# EAGLE design Trap Lighting Programmable SpectrumV03B (EAGLE 8.4.3)
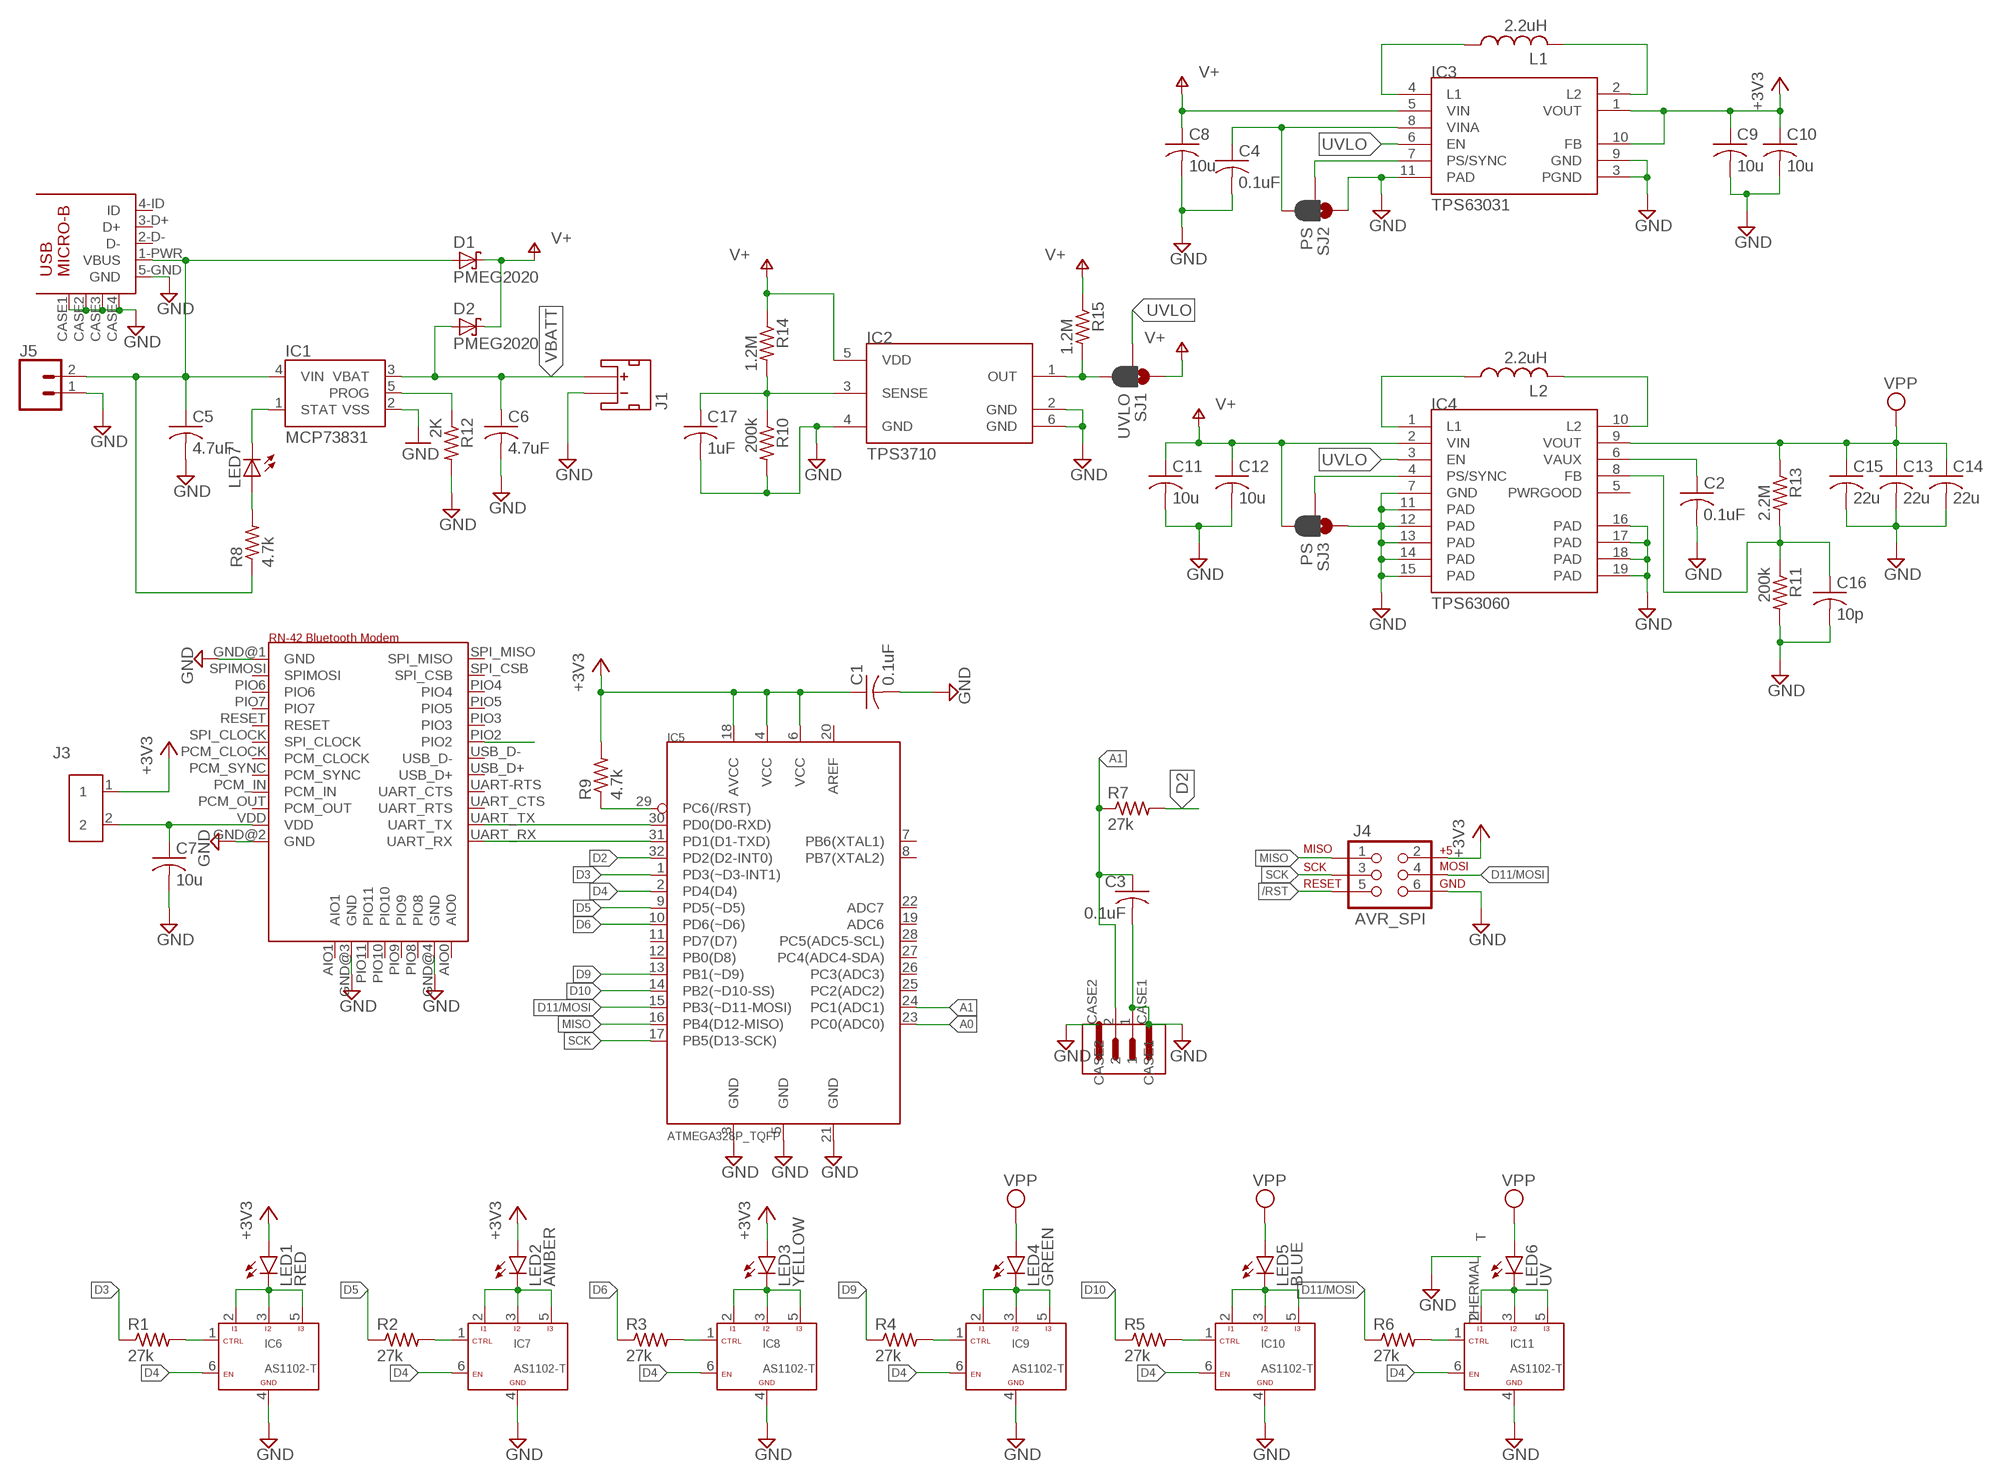
[diagram p0: schematic, sheet 1]

## Parts
A1  RN-42_BLUETOOTH  [RN-42]
C1  0.1uF  C-USC0805  [C0805]
C2  0.1uF  C-USC0805  [C0805]
C3  0.1uF  C-USC0805  [C0805]
C4  0.1uF  C-USC0805  [C0805]
C5  4.7uF  C-USC0805  [C0805]
C6  4.7uF  C-USC0805  [C0805]
C7  10u  C-USC0805  [C0805]
C8  10u  C-USC0805  [C0805]
C9  10u  C-USC0805  [C0805]
C10  10u  C-USC0805  [C0805]
C11  10u  C-USC0805  [C0805]
C12  10u  C-USC0805  [C0805]
C13  22u  C-USC1206  [C1206]
C14  22u  C-USC1206  [C1206]
C15  22u  C-USC1206  [C1206]
C16  10p  C-USC0805  [C0805]
C17  1uF  C-USC0805  [C0805]
D1  PMEG2020  BAT60J  [SOD323_ST]
D2  PMEG2020  BAT60J  [SOD323_ST]
IC1  MCP73831  MCP73831SMD  [SOT23-5]
IC2  TPS3710  [SOT6]
IC3  TPS63031  [VSON-10]
IC4  TPS63060  [WSON1-10]
IC5  ATMEGA328P_TQFP  [TQFP-32]
IC6  AS1102-T  [SC70-6]
IC7  AS1102-T  [SC70-6]
IC8  AS1102-T  [SC70-6]
IC9  AS1102-T  [SC70-6]
IC10  AS1102-T  [SC70-6]
IC11  AS1102-T  [SC70-6]
J1  JST_2MM_MALE  [JST-2-SMD]
J2  2PIN_SMD_PHOENIX_CONTACTVERTICAL_PACKAGE  [2-PIN-VERT-PHOENIX_SMD]
J3  2MM_SMD_M_HEADER  [2MM_MALE_SMD_HEADER]
J4  AVR_SPI  AVR_SPI_PRG_6PTH  [2X3]
J5  CONN_02PTH3  [1X02_LONGPADS]
L1  2.2uH  VLF302512MT-2R2M-CA_INDUCTOR  [VLF302512MT-2R2M-CA_INDUCTOR]
L2  2.2uH  VLF302512MT-2R2M-CA_INDUCTOR  [VLF302512MT-2R2M-CA_INDUCTOR]
LED1  RED  LED_TT_OVS5MXTT_OVS5MX  [LED_TT_OVS5MX]
LED2  AMBER  LED_TT_OVS5MXTT_OVS5MX  [LED_TT_OVS5MX]
LED3  YELLOW  LED_TT_OVS5MXTT_OVS5MX  [LED_TT_OVS5MX]
LED4  GREEN  LED_TT_OVS5MXLUXEON_3535L  [LED_LUXEON_3535L]
LED5  BLUE  LED_TT_OVS5MXTT_OVS5MX  [LED_TT_OVS5MX]
LED6  UV  LITEON_CO34UV_LED  [LED_LITEON_CO3_UV]
LED7  LEDCHIPLED_0805  [CHIPLED_0805]
R1  27k  R-US_R0805  [R0805]
R2  27k  R-US_R0805  [R0805]
R3  27k  R-US_R0805  [R0805]
R4  27k  R-US_R0805  [R0805]
R5  27k  R-US_R0805  [R0805]
R6  27k  R-US_R0805  [R0805]
R7  27k  R-US_R0805  [R0805]
R8  4.7k  R-US_R0805  [R0805]
R9  4.7k  R-US_R0805  [R0805]
R10  200k  R-US_R0805  [R0805]
R11  200k  R-US_R0805  [R0805]
R12  2K  R-US_R0805  [R0805]
R13  2.2M  R-US_R0805  [R0805]
R14  1.2M  R-US_R0805  [R0805]
R15  1.2M  R-US_R0805  [R0805]
SJ1  UVLO  JUMPER-SMT_3_1-NC_PASTE_SILK  [SMT-JUMPER_3_1-NC_PASTE_SILK]
SJ2  PS  JUMPER-SMT_3_1-NC_PASTE_SILK  [SMT-JUMPER_3_1-NC_PASTE_SILK]
SJ3  PS  JUMPER-SMT_3_1-NC_PASTE_SILK  [SMT-JUMPER_3_1-NC_PASTE_SILK]
USB1  USB-MICRO-B  [USB_MICRO_B_WURTH_629105136821]

## Nets
3.3V: C1.1 C9.1 C10.1 IC3.1(VOUT) IC3.10(FB) IC5.4(VCC) IC5.6(VCC) IC5.18(AVCC) J3.1 J4.2 LED1.A LED2.A LED3.A R9.2 ; supply symbol labelled +3V3
/RST: IC5.29(PC6(/RST)) J4.5 R9.1
A0: IC5.23(PC0(ADC0))
A1: C3.1 IC5.24(PC1(ADC1)) J2.2 R7.1
BT_CONNECT: A1.PIO2
D2: IC5.32(PD2(D2-INT0)) R7.2
D3: IC5.1(PD3(~D3-INT1)) R1.1
D4: IC5.2(PD4(D4)) IC6.6(EN) IC7.6(EN) IC8.6(EN) IC9.6(EN) IC10.6(EN) IC11.6(EN)
D5: IC5.9(PD5(~D5)) R2.1
D6: IC5.10(PD6(~D6)) R3.1
D9: IC5.13(PB1(~D9)) R4.1
D10: IC5.14(PB2(~D10-SS)) R5.1
D11/MOSI: IC5.15(PB3(~D11-MOSI)) J4.4 R6.1
GND: A1.GND@1(GND) A1.GND@2(GND) A1.GND@3(GND) A1.GND@4(GND) C1.2 C2.2 C3.2 C4.2 C5.2 C6.2 C7.2 C8.2 C9.2 C10.2 C11.2 C12.2 C13.2 C14.2 C15.2 C16.2 C17.2 IC1.2(VSS) IC2.2(GND) IC2.4(GND) IC2.6(GND) IC3.3(PGND) IC3.9(GND) IC3.11(PAD) IC4.7(GND) IC4.11(PAD) IC4.12(PAD) IC4.13(PAD) IC4.14(PAD) IC4.15(PAD) IC4.16(PAD) IC4.17(PAD) IC4.18(PAD) IC4.19(PAD) IC5.3(GND) IC5.5(GND) IC5.21(GND) IC6.4(GND) IC7.4(GND) IC8.4(GND) IC9.4(GND) IC10.4(GND) IC11.4(GND) J1.1(-) J2.1 J2.CASE1 J2.CASE2 J4.6 J5.1 LED6.THERMAL(T) R10.2 R11.2 R12.2 SJ2.1 SJ3.1 USB1.5-GND(GND) USB1.CASE1(CASE) USB1.CASE2(CASE) USB1.CASE3(CASE) USB1.CASE4(CASE)
MCURX: A1.UART_TX IC5.30(PD0(D0-RXD))
MCUTX: A1.UART_RX IC5.31(PD1(D1-TXD))
MISO: IC5.16(PB4(D12-MISO)) J4.1
N$1: IC1.1(STAT) LED7.C
N$2: IC8.1(CTRL) R3.2
N$3: IC9.1(CTRL) R4.2
N$4: IC2.1(OUT) R15.2 SJ1.3
N$5: A1.VDD C7.1 J3.2
N$6: IC10.1(CTRL) R5.2
N$7: IC11.1(CTRL) R6.2
N$8: IC7.1(CTRL) R2.2
N$9: LED7.A R8.2
N$11: IC1.5(PROG) R12.1
N$12: C17.1 IC2.3(SENSE) R10.1 R14.2
N$13: IC3.2(L2) L1.2
N$14: IC3.4(L1) L1.1
N$15: IC3.7(PS/SYNC) SJ2.2
N$17: IC8.2(I1) IC8.3(I2) IC8.5(I3) LED3.C
N$18: IC9.2(I1) IC9.3(I2) IC9.5(I3) LED4.C
N$19: IC10.2(I1) IC10.3(I2) IC10.5(I3) LED5.C
N$20: IC11.2(I1) IC11.3(I2) IC11.5(I3) LED6.K(C)
N$21: IC7.2(I1) IC7.3(I2) IC7.5(I3) LED2.C
N$22: IC6.1(CTRL) R1.2
N$23: C4.1 IC3.8(VINA) SJ2.3
N$24: IC6.2(I1) IC6.3(I2) IC6.5(I3) LED1.C
N$26: IC4.4(PS/SYNC) SJ3.2
N$27: IC4.1(L1) L2.1
N$28: IC4.10(L2) L2.2
N$30: C2.1 IC4.6(VAUX)
N$31: C16.1 IC4.8(FB) R11.1 R13.2
SCK: IC5.17(PB5(D13-SCK)) J4.3
USB_VIN: C5.1 D1.A IC1.4(VIN) J5.2 R8.1 USB1.1-PWR(VBUS)
UVLO: IC3.6(EN) IC4.3(EN) SJ1.2
V+: C8.1 C11.1 C12.1 D1.C D2.C IC2.5(VDD) IC3.5(VIN) IC4.2(VIN) R14.1 R15.1 SJ1.1 SJ3.3
VBATT: C6.1 D2.A IC1.3(VBAT) J1.2(+)
VPP: C13.1 C14.1 C15.1 IC4.9(VOUT) LED4.A LED5.A LED6.A R13.1
Unconnected: A1.AIO0 A1.AIO1 A1.PCM_CLOCK A1.PCM_IN A1.PCM_OUT A1.PCM_SYNC A1.PIO3 A1.PIO4 A1.PIO5 A1.PIO6 A1.PIO7 A1.PIO8 A1.PIO9 A1.PIO10 A1.PIO11 A1.RESET A1.SPI_CLOCK A1.SPI_CSB A1.SPI_MISO A1.SPIMOSI A1.UART-RTS(UART_CTS) A1.UART_CTS(UART_RTS) A1.USB_D+ A1.USB_D- IC4.5(PWRGOOD) IC5.7(PB6(XTAL1)) IC5.8(PB7(XTAL2)) IC5.11(PD7(D7)) IC5.12(PB0(D8)) IC5.19(ADC6) IC5.20(AREF) IC5.22(ADC7) IC5.25(PC2(ADC2)) IC5.26(PC3(ADC3)) IC5.27(PC4(ADC4-SDA)) IC5.28(PC5(ADC5-SCL)) J1.NC1(PAD1) J1.NC2(PAD2) USB1.2-D-(D-) USB1.3-D+(D+) USB1.4-ID(ID)

## Library data of the parts
A1 = be-420-custom-parts:RN-42_BLUETOOTH
C1-C17 = rcl:C-US: CAPACITOR, American symbol
D1 D2 = diode:BAT60J: Schottky barrier diode Source: www.st.com, BAT60J.pdf
IC1 = SparkFun:MCP73831
IC2 = 1A_Jenkins_2013:TPS3710: TPS3710 Power supply supervisor / comparator
IC3 = 1A_Jenkins_2013:TPS63031: TPS63031 buck-boost 3.3V regulator, 1 A
IC4 = 1A_Jenkins_2013:TPS63060: TPS63060 BUCK-BOOST 2A Regulator, WSON10 Package
IC5 = 1A_Jenkins_2013:ATMEGA328P_TQFP
IC6-IC11 = 1A_Jenkins_2013:AS1102-T
J1 = SparkFun-Connectors:JST_2MM_MALE: JST 2MM MALE RA CONNECTOR Two pin, compact surface mount connector. Commonly used as a battery input connection point. We really like the solid locking feeling and high current rating on these small connectors. We use these all the time as battery connectors. Mates to single-cell LiPo batteries. Here is the connector we sell at SparkFun: JST Right Angle Connector - White <https://www.sparkfun.com/products/8612> (PRT-08612) Datasheet <http://www.sparkfun.com/datasheets/Prototyping/Connectors/JST-Horizontal.pdf> It was used on these SparkFun products: SparkFun MOSFET Power Controller <https://www.sparkfun.com/products/11214> (PRT-11214) SparkFun Battery Babysitter - LiPo Battery Manager <https://www.sparkfun.com/products/13777> (PRT-13777) And many, many others that required a lipo battery connection.; PROD_ID: CONN-11443; SF_ID: PRT-08612
J2 = 1A_Jenkins_2013:2PIN_SMD_PHOENIX_CONTACT
J3 = 1A_Jenkins_2013:2MM_SMD_M_HEADER
J4 = SparkFun:AVR_SPI_PRG_6: AVR ISP 6 Pin This is the reduced ISP connector for AVR programming. Common on Arduino. This footprint will take up less PCB space and can be used with a 10-pin to 6-pin adapter such as SKU: BOB-08508
J5 = SparkFun-Connectors:CONN_02: Multi connection point. Often used as Generic Header-pin footprint for 0.1 inch spaced/style header connections On any of the 0.1 inch spaced packages, you can populate with these: Break Away Headers - Straight <https://www.sparkfun.com/products/116> (PRT-00116) Break Away Male Headers - Right Angle <https://www.sparkfun.com/products/553> (PRT-00553) Female Headers <https://www.sparkfun.com/products/115> (PRT-00115) Break Away Headers - Machine Pin <https://www.sparkfun.com/products/117> (PRT-00117) Break Away Female Headers - Swiss Machine Pin <https://www.sparkfun.com/products/743> (PRT-00743) For SCREWTERMINALS and SPRING TERMINALS visit here: Screw Terimnals on SparkFun.com <https://www.sparkfun.com/search/results?term=Screw+Terminals> (5mm/3.5mm/2.54mm spacing) This device is also useful as a general connection point to wire up your design to another part of your project. Our various solder wires solder well into these plated through hole pads. Hook-Up Wire - Assortment (Stranded, 22 AWG) <https://www.sparkfun.com/products/11375> (PRT-11375) Hook-Up Wire - Assortment (Solid Core, 22 AWG) <https://www.sparkfun.com/products/11367> (PRT-11367) View the entire wire category on our website here <https://www.sparkfun.com/categories/141> Special notes: Molex polarized connector foot print use with: PRT-08233 with associated crimp pins and housings. 2.54_SCREWTERM for use with PRT-10571. 3.5mm Screw Terminal footprints for PRT-08084 5mm Screw Terminal footprints for use with PRT-08432
L1 L2 = 1A_Jenkins_2013:VLF302512MT-2R2M-CA_INDUCTOR
LED1-LED5 = 1A_Jenkins_2013:LED_TT_OVS5MX
LED6 = 1A_Jenkins_2013:LITEON_CO34UV_LED
LED7 = led:LED: LED OSRAM: - CHIPLED LG R971, LG N971, LY N971, LG Q971, LY Q971, LO R971, LY R971 LH N974, LH R974 LS Q976, LO Q976, LY Q976 LO Q996 - Hyper CHIPLED LW Q18S LB Q993, LB Q99A, LB R99A - SideLED LS A670, LO A670, LY A670, LG A670, LP A670 LB A673, LV A673, LT A673, LW A673 LH A674 LY A675 LS A676, LA A676, LO A676, LY A676, LW A676 LS A679, LY A679, LG A679 - Hyper Micro SIDELED® LS Y876, LA Y876, LO Y876, LY Y876 LT Y87S - SmartLED LW L88C, LW L88S LB L89C, LB L89S, LG L890 LS L89K, LO L89K, LY L89K LS L896, LA L896, LO L896, LY L896 - TOPLED LS T670, LO T670, LY T670, LG T670, LP T670 LSG T670, LSP T670, LSY T670, LOP T670, LYG T670 LG T671, LOG T671, LSG T671 LB T673, LV T673, LT T673, LW T673 LH T674 LS T676, LA T676, LO T676, LY T676, LB T676, LH T676, LSB T676, LW T676 LB T67C, LV T67C, LT T67C, LS T67K, LO T67K, LY T67K, LW E67C LS E67B, LA E67B, LO E67B, LY E67B, LB E67C, LV E67C, LT E67C LW T67C LS T679, LY T679, LG T679 LS T770, LO T770, LY T770, LG T770, LP T770 LB T773, LV T773, LT T773, LW T773 LH T774 LS E675, LA E675, LY E675, LS T675 LS T776, LA T776, LO T776, LY T776, LB T776 LHGB T686 LT T68C, LB T68C - Hyper Mini TOPLED® LB M676 - Mini TOPLED Santana® LG M470 LS M47K, LO M47K, LY M47K Source: http://www.osram.convergy.de LUXEON: - LUMILED® LXK2-PW12-R00, LXK2-PW12-S00, LXK2-PW14-U00, LXK2-PW14-V00 LXK2-PM12-R00, LXK2-PM12-S00, LXK2-PM14-U00 LXK2-PE12-Q00, LXK2-PE12-R00, LXK2-PE12-S00, LXK2-PE14-T00, LXK2-PE14-U00 LXK2-PB12-K00, LXK2-PB12-L00, LXK2-PB12-M00, LXK2-PB14-N00, LXK2-PB14-P00, LXK2-PB14-Q00 LXK2-PR12-L00, LXK2-PR12-M00, LXK2-PR14-Q00, LXK2-PR14-R00 LXK2-PD12-Q00, LXK2-PD12-R00, LXK2-PD12-S00 LXK2-PH12-R00, LXK2-PH12-S00 LXK2-PL12-P00, LXK2-PL12-Q00, LXK2-PL12-R00 Source: www.luxeon.com KINGBRIGHT: KA-3528ASYC Source: www.kingbright.com
R1-R15 = rcl:R-US_: RESISTOR, American symbol
SJ1-SJ3 = SparkFun-Jumpers:JUMPER-SMT_3_1-NC_PASTE: Normally closed solder jumper (1 of 2 connections) This jumper has an aperture in the stencil to allow solder paste to bridge one of the two connections. One connection is normally closed (NC), while the other is normally open (NO). Wick off the solder to open the connection. Reapply solder to reclose the connection. Apply solder to the other side instead to change the current path.
USB1 = 1A_Jenkins_2013:USB-MICRO-B

## Net classes
1 VCC: width 0.381 mm
2 LEDPower: width 0.203 mm
3 ButtonSignal: width 0.203 mm

## Board
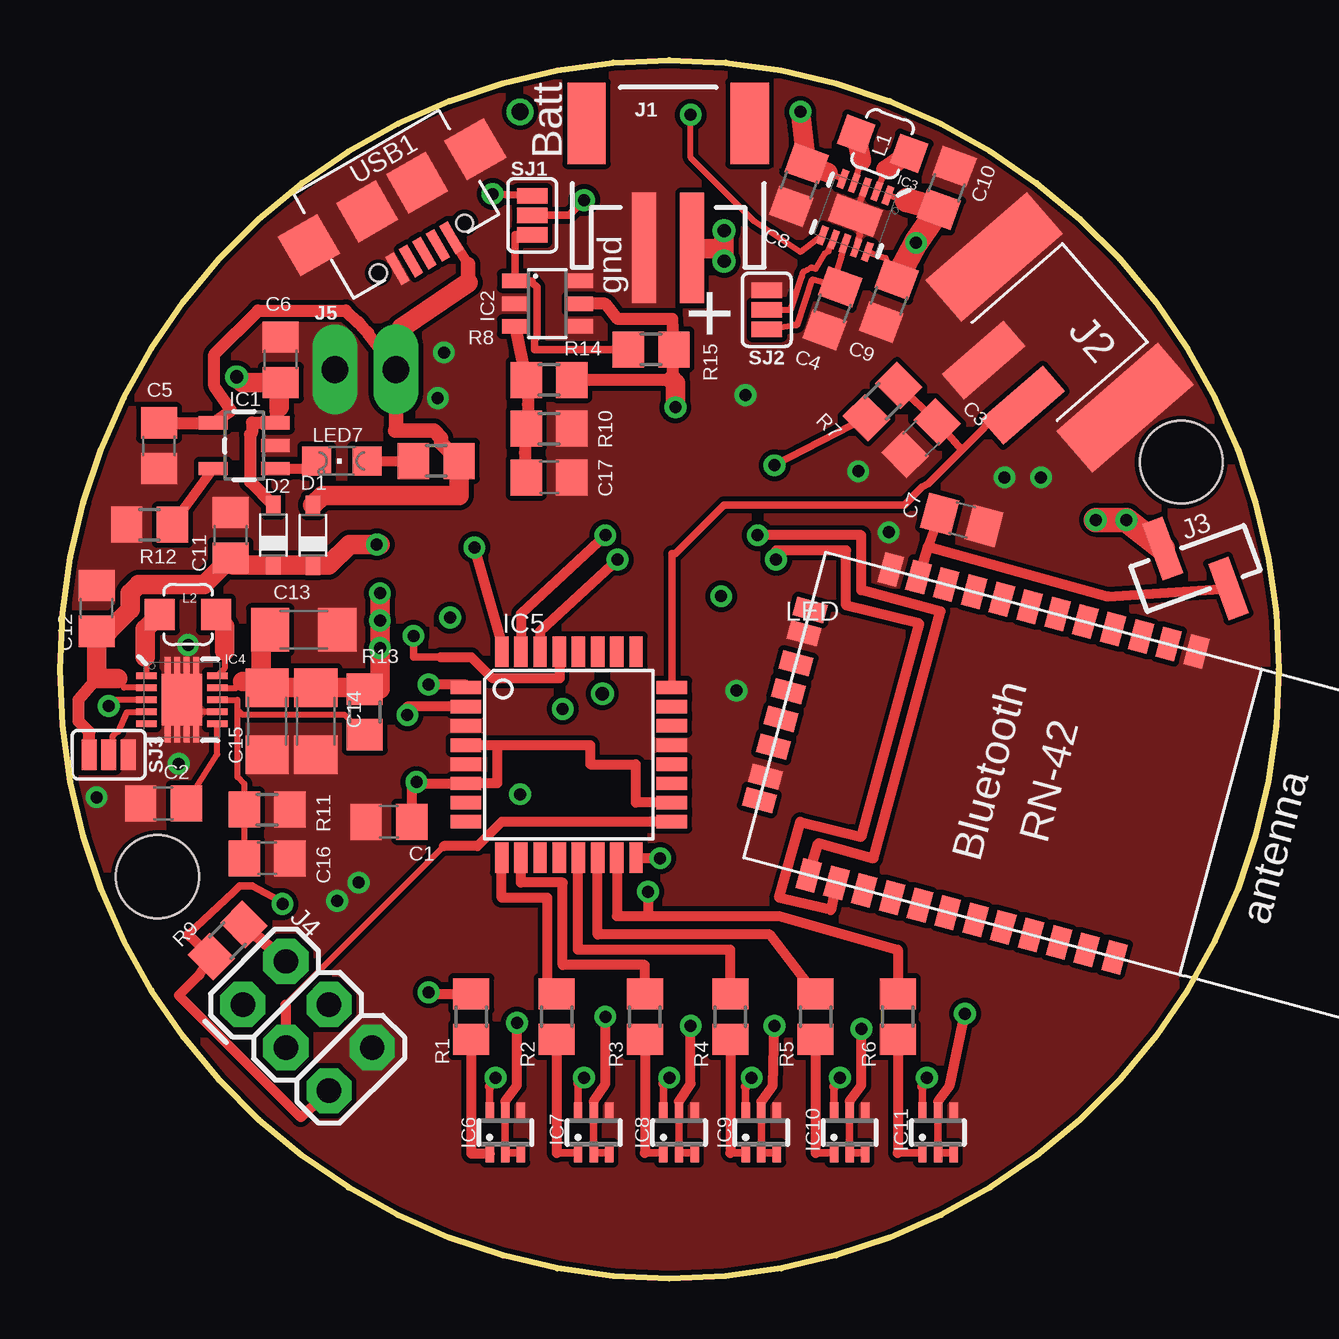
[diagram p1: board, top side]
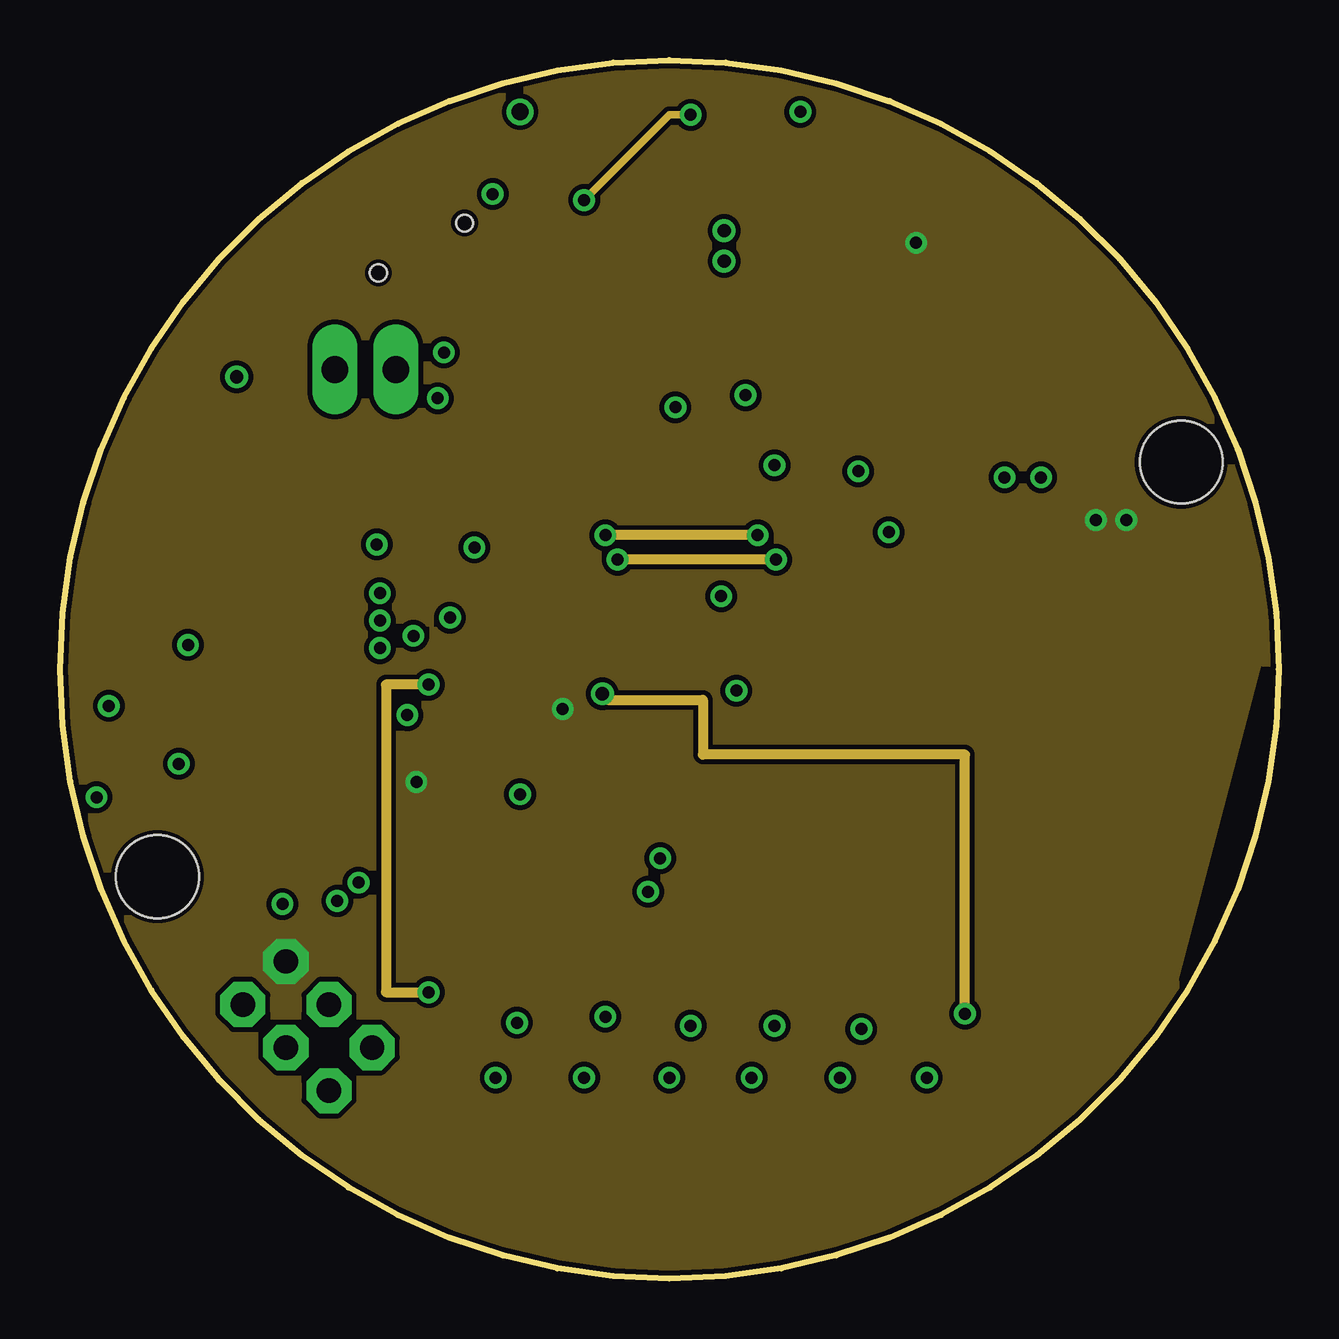
[diagram p2: board, inner layer Route2]
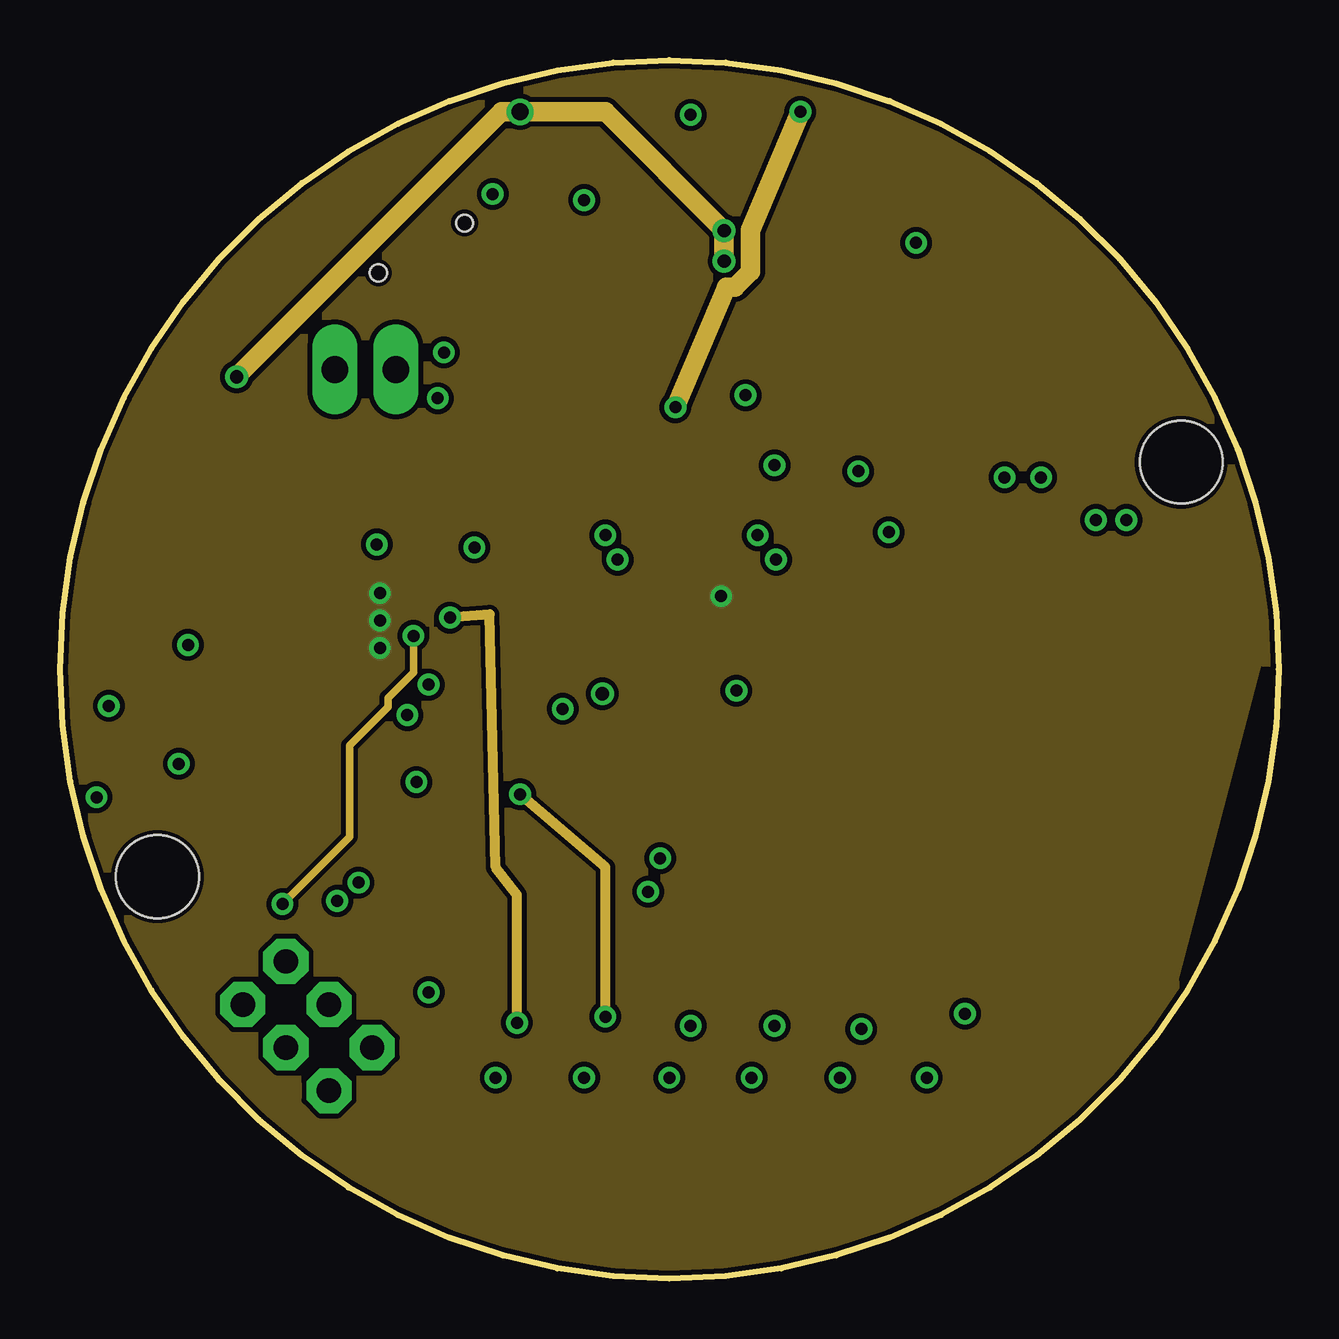
[diagram p3: board, inner layer Route15]
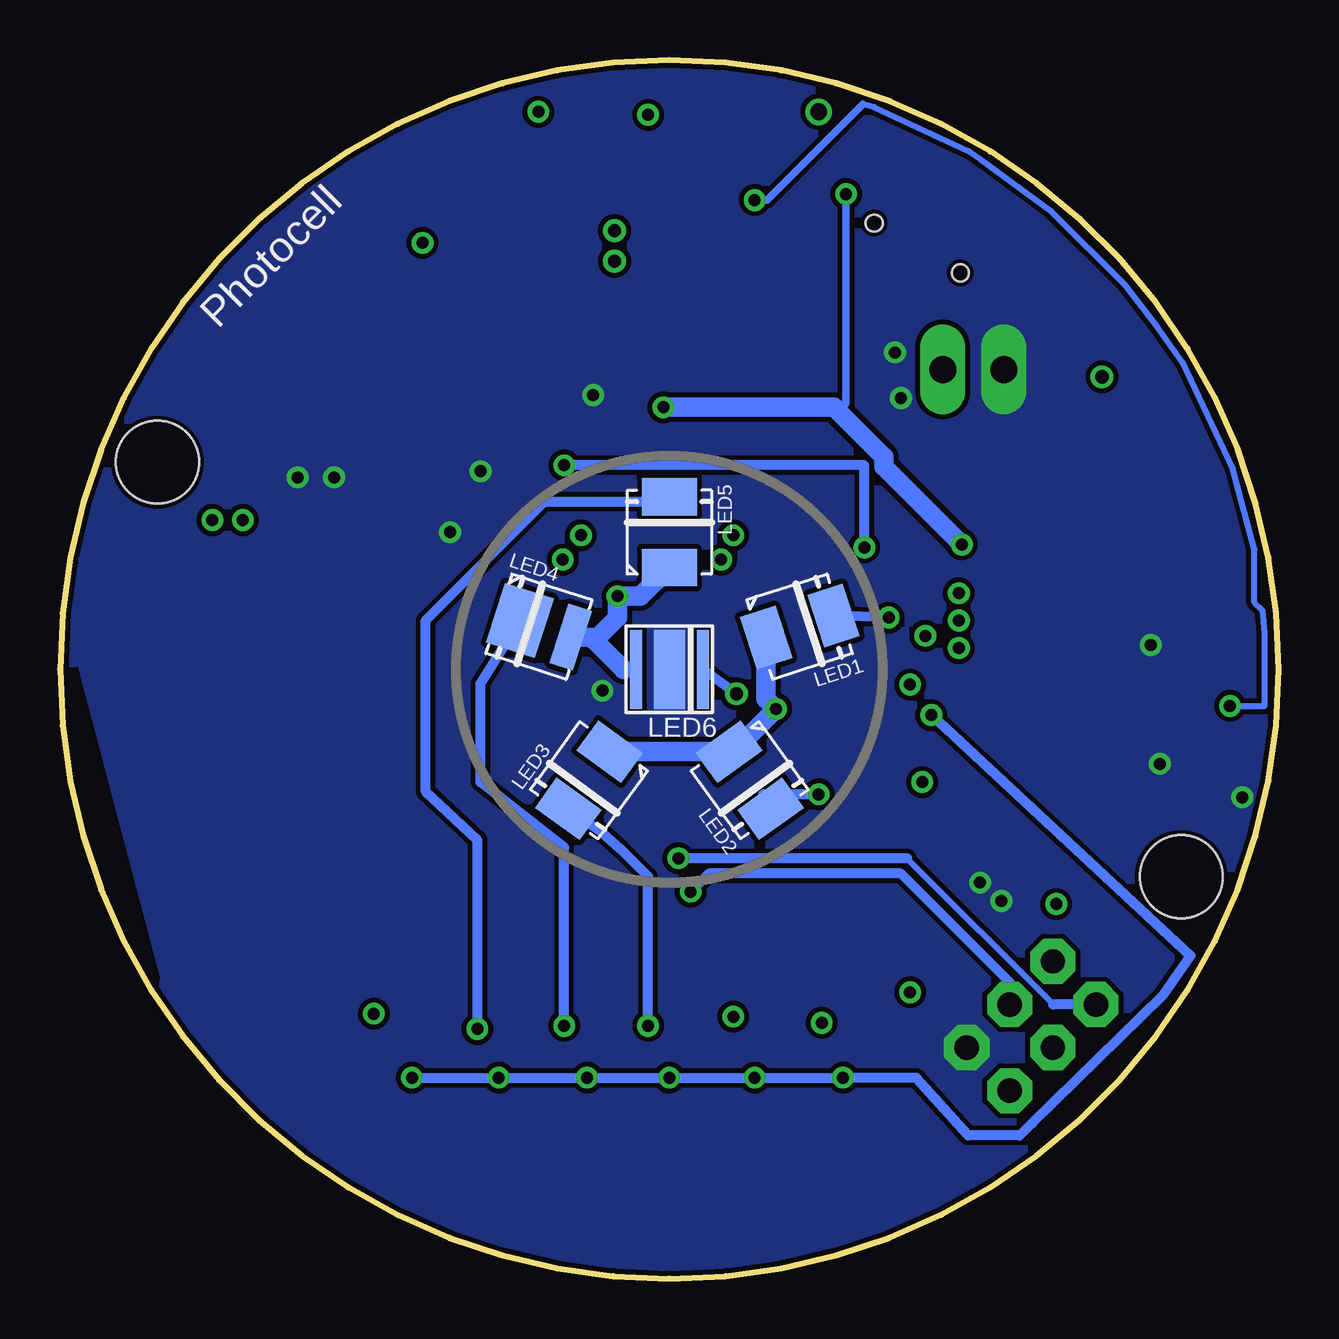
[diagram p4: board, bottom side, seen from below]

Size 50.8 x 50.8 mm. Coordinates in mm from the lower left corner, seen from the top.
Outline: 0,25.4 arc-90 25.4,50.8 arc-90 50.8,25.4 arc-90 25.4,0 arc-90 0,25.4
Copper layers (1+2*15+16): Top 0.035mm / dielectric 0.5mm / Route2 0.035mm / dielectric 0.5mm / Route15 0.035mm / dielectric 0.5mm / Bottom 0.035mm
Design rules "default *": minimum track width 10mil, minimum drill 16mil, track to track 8mil, track to pad 8mil, pad to pad 8mil, via to via 8mil, smd to smd 8mil, copper to edge 8mil, drill to drill 8mil, minimum pad ring 10mil, minimum via ring 8mil, stop-mask expansion 4mil, vias tented up to drill 0mil, thermal gap 10mil
Holes 3.45 mm at 46.74,34.04 4.06,16.76

### Footprints (pad centres in the part's own frame; a part is rotated, then mirrored left to right if it is on the bottom)
RN-42 = smd 0.8 x 1.3: AIO0 4.1,-12.9; AIO1 -4.1,-12.9; GND@3 -3.1,-12.9; GND@4 3.1,-12.9; PIO8 1.8,-12.9; PIO9 0.6,-12.9; PIO10 -0.6,-12.9; PIO11 -1.8,-12.9 | smd 1.3 x 0.8: GND@1 -6.6,3.1; GND@2 -6.6,-10.1; PCM_CLOCK -6.6,-4.1; PCM_IN -6.6,-6.5; PCM_OUT -6.6,-7.7; PCM_SYNC -6.6,-5.3; PIO2 6.6,-2.9; PIO3 6.6,-1.7; PIO4 6.6,0.7; PIO5 6.6,-0.5; PIO6 -6.6,0.7; PIO7 -6.6,-0.5; RESET -6.6,-1.7; SPI_CLOCK -6.6,-2.9; SPI_CSB 6.6,1.9; SPI_MISO 6.6,3.1; SPIMOSI -6.6,1.9; UART-RTS 6.6,-7.7; UART_CTS 6.6,-6.5; UART_RX 6.6,-10.1; UART_TX 6.6,-8.9; USB_D+ 6.6,-5.3; USB_D- 6.6,-4.1; VDD -6.6,-8.9
C0805 = smd 1.3 x 1.5: 1 -0.95,0; 2 0.95,0
C1206 = smd 1.6 x 1.8: 1 -1.4,0; 2 1.4,0
SOD323_ST = smd 0.8 x 0.6: A 1.25,0; C -1.25,0
SOT23-5 = smd 0.55 x 1.2: 1 -0.95,-1.3; 2 0,-1.3; 3 0.95,-1.3; 4 0.95,1.3; 5 -0.95,1.3
SOT6 = smd 1.1 x 0.6: 1 -1.35,0.95; 2 -1.35,0; 3 -1.35,-0.95; 4 1.35,-0.95; 5 1.35,0; 6 1.35,0.95
VSON-10 = smd 0.8 x 0.28: 1 -1.25,1; 2 -1.25,0.5; 3 -1.25,0; 4 -1.25,-0.5; 5 -1.25,-1; 6 1.25,-1; 7 1.25,-0.5; 8 1.25,0; 9 1.25,0.5; 10 1.25,1 | smd 1.2 x 2: 11 0,0
WSON1-10 = smd 0.85 x 0.28: 1 -1.475,1; 2 -1.475,0.5; 3 -1.475,0; 4 -1.475,-0.5; 5 -1.475,-1; 6 1.475,-1; 7 1.475,-0.5; 8 1.475,0; 9 1.475,0.5; 10 1.475,1 | smd 0.25 x 0.8: 11 0.6,1.375; 12 0.2,1.375; 13 -0.2,1.375; 14 -0.6,1.375; 15 -0.6,-1.375; 16 -0.2,-1.375; 17 0.2,-1.375; 18 0.6,-1.375 | smd 1.7 x 2.15: 19 0,0
TQFP-32 = smd 1.27 x 0.559: 1 -4.293,2.8; 2 -4.293,2; 3 -4.293,1.2; 4 -4.293,0.4; 5 -4.293,-0.4; 6 -4.293,-1.2; 7 -4.293,-2; 8 -4.293,-2.8; 17 4.293,-2.8; 18 4.293,-2; 19 4.293,-1.2; 20 4.293,-0.4; 21 4.293,0.4; 22 4.293,1.2; 23 4.293,2; 24 4.293,2.8 | smd 0.559 x 1.27: 9 -2.8,-4.293; 10 -2,-4.293; 11 -1.2,-4.293; 12 -0.4,-4.293; 13 0.4,-4.293; 14 1.2,-4.293; 15 2,-4.293; 16 2.8,-4.293; 25 2.8,4.293; 26 2,4.293; 27 1.2,4.293; 28 0.4,4.293; 29 -0.4,4.293; 30 -1.2,4.293; 31 -2,4.293; 32 -2.8,4.293
SC70-6 = smd 0.8 x 0.35: 1 -0.85,0.63; 2 -0.85,-0.02; 3 -0.85,-0.67; 4 0.85,-0.67; 5 0.85,-0.02; 6 0.85,0.63
JST-2-SMD = smd 1 x 4.6: 1 -1,-3.7; 2 1,-3.7 | smd 1.6 x 3.4: NC1 -3.4,1.5; NC2 3.4,1.5
2-PIN-VERT-PHOENIX_SMD = smd 3.4 x 1.4: 1 -3.15,1.21; 2 -3.15,-1.29 | smd 5.6 x 2.3: CASE1 0,4.16; CASE2 0,-4.16
2MM_MALE_SMD_HEADER = smd 0.89 x 2.5: 1 -1,1.25; 2 1,-1.25
2X3 = drill 1.016 pad 1.88 octagon: 1 0,0; 2 0,2.54; 3 2.54,0; 4 2.54,2.54; 5 5.08,0; 6 5.08,2.54
1X02_LONGPADS = drill 1.118 pad 1.88 long: 1 0,0; 2 2.54,0
VLF302512MT-2R2M-CA_INDUCTOR = smd 1.25 x 1.3: 1 -1.175,0; 2 1.175,0
LED_TT_OVS5MX = smd 1.55 x 2.3: A 1.475,0; C -1.475,0
LED_LUXEON_3535L = smd 1.02 x 2.6: A 1.39,0 | smd 2.13 x 2.6: C -0.835,0
LED_LITEON_CO3_UV = smd 0.5 x 3.3: A 1.4,0; K -1.4,0 | smd 1.3 x 3.3: THERMAL 0,0
CHIPLED_0805 = smd 1.2 x 1.2: A 0,-1.05; C 0,1.05
R0805 = smd 1.3 x 1.5: 1 -0.95,0; 2 0.95,0
SMT-JUMPER_3_1-NC_PASTE_SILK = smd 0.635 x 1.27: 1 -0.813,0; 2 0,0; 3 0.813,0
USB_MICRO_B_WURTH_629105136821 = smd 0.4 x 1.35: 1-PWR -1.3,2.7; 2-D- -0.65,2.7; 3-D+ 0,2.7; 4-ID 0.65,2.7; 5-GND 1.3,2.7 | smd 1.9 x 1.9: CASE1 -4,0; CASE2 -1.2,0; CASE3 1.2,0; CASE4 4,0 | hole 0.7: -2.075,2.45; 2.075,2.45

### Placement (x,y rotation side)
A1  42.67,20.57 255 top
C1  13.72,19.05 180 top
C2  4.32,19.81 180 top
C3  35.89,35.04 225 top
C4  32.19,40.45 250 top
C5  4.13,34.72 270 top
C6  9.2,38.3 90 top
C7  37.59,31.62 345 top
C8  30.8,45.59 250 top
C9  34.54,40.77 250 top
C10  36.96,45.47 70 top
C11  7.11,30.99 90 top
C12  1.52,27.94 90 top
C13  10.16,27.05 0 top
C14  10.67,23.24 270 top
C15  8.64,23.24 270 top
C16  8.64,17.53 0 top
C17  20.38,33.4 0 top
D1  10.54,30.99 90 top
D2  8.89,31 90 top
IC1  7.68,34.72 90 top
IC2  20.32,40.64 0 top
IC3  33.15,44.32 250 top
IC4  5.08,24.13 0 top
IC5  21.21,21.84 0 top
IC6  18.54,6.1 90 top
IC7  22.23,6.1 90 top
IC8  25.78,6.1 90 top
IC9  29.21,6.1 90 top
IC10  32.89,6.1 90 top
IC11  36.58,6.1 90 top
J1  25.35,46.66 0 top
J2  41.67,39.45 41 top
J3  47.33,29.6 20 top
J4  7.62,11.43 315 top
J5  11.46,37.9 0 top
L1  34.29,47.31 340 top
L2  5.33,27.69 0 top
LED1  19.96,27.18 198 bottom
LED2  22.05,20.78 126 bottom
LED3  28.75,20.78 54 bottom
LED4  30.84,27.18 342 bottom
LED5  25.4,31.11 270 bottom
LED6  25.4,25.4 180 bottom
LED7  11.75,34.09 90 top
R1  17.14,10.92 270 top
R2  20.7,10.92 270 top
R3  24.38,10.92 270 top
R4  27.94,10.92 270 top
R5  31.5,10.92 270 top
R6  34.92,10.92 270 top
R7  34.29,36.56 225 top
R8  15.68,34.09 180 top
R9  6.99,14.1 45 top
R10  20.38,35.43 0 top
R11  8.64,19.56 0 top
R12  3.73,31.43 180 top
R13  12.7,23.62 270 top
R14  20.38,37.47 180 top
R15  24.64,38.73 180 top
SJ1  19.68,44.32 270 top
SJ2  29.46,40.39 270 top
SJ3  2.03,21.84 180 top
USB1  13.84,45.09 210 top

### Tracks (layer width: path | path; a pad name or v marks a point on that pad's centre or on a via)
3.3V  (via drill 0.5)
  Top 0.254: IC3.1 35.31,44.96 | IC3.10 34.42,42.55 C9.1
  Top 0.406: IC5.18 24,19.84 24,21.44 22.1,21.44 22.1,22.24 IC5.4 18.22,22.24 18.22,20.64 IC5.6 14.86,20.64 v14.86,20.7 14.67,20.7 C1.1
  Top 0.508: R9.2 J4.2
  Top 1.016: v43.18,31.62 v44.45,31.62 J3.1 | 35.31,44.96 C10.1 v35.69,43.18 C9.1
  Bottom 0.508: LED2.A 22.73,21.97
  Bottom 0.813: LED1.A 21.37,24.16 v20.95,23.75 22.73,21.97 | LED3.A LED2.A
  pour Route2 (no thermals): 0,50.8 50.8,50.8 50.8,25.53 49.91,25.78 46.35,12.32 50.8,11.05 50.8,0 0,0
/RST  (via drill 0.5)
  Top 0.305: 5.33,14.35 7.24,16.13 7.49,16.38 8,16.38 9.4,15.62 v9.27,15.62 | v14.73,26.8 14.73,25.91 15.88,25.91
  Top 0.406: J4.5 10.03,6.73 4.95,11.81 5.8,12.66 R9.1 5.33,14.35 | IC5.29 20.83,26.14 20.83,25.02 18.03,25.02 17.14,25.91 15.88,25.91
  Route15 0.305: v9.27,15.62 12.06,18.41 12.06,22.23 13.67,23.83 13.67,24.21 14.73,25.27 v14.73,26.8
A1
  Top 0.305: R7.1 C3.1 37.59,34.54 | 37.59,34.54 36.19,33.14 35.94,33 35.2,32.26 27.69,32.26 25.65,30.23 25.5,30.23 IC5.24 | J2.2 39.46,36.41 37.59,34.54
  Top 0.406: IC5.24 25.12,24.64
D2  (via drill 0.5)
  Top 0.305: R7.2 v29.78,33.91
  Top 0.406: IC5.32 18.41,26.55 v17.27,30.48
  Bottom 0.406: v17.27,30.48 17.27,33.91 v29.78,33.91
D3  (via drill 0.5)
  Top 0.406: IC5.1 16.92,24.77 v15.37,24.77 | v15.37,11.94 15.37,11.87 R1.1
  Route2 0.406: v15.37,24.77 13.59,24.77 13.59,11.94 v15.37,11.94
D4  (via drill 0.5)
  Top 0.305: v18.16,8.38 arc90 17.91,8.13 IC6.6 | v21.84,8.38 arc90 21.59,8.13 IC7.6 | v25.4,8.38 arc90 25.15,8.13 IC8.6 | 28.58,8.01 IC9.6 | 32.26,8.01 IC10.6 | IC11.6 35.95,8.01
  Top 0.406: IC5.2 14.48,23.84 v14.48,23.5 | 17.91,8 v18.16,8.38 | 21.59,8.13 v21.84,8.38 | 25.15,8.13 v25.4,8.38 | v28.83,8.38 28.58,8.01 | v32.51,8.38 32.26,8.01 | 35.95,8.01 v36.13,8.38
  Bottom 0.406: v14.48,23.5 3.68,13.46 4.83,11.81 10.29,6.48 10.79,5.97 12.95,5.97 15.11,8.38 v18.16,8.38 v21.84,8.38 v25.4,8.38 v28.83,8.38 v32.51,8.38 v36.13,8.38
D5
  Top 0.406: R2.1 20.32,11.87 20.32,15.88 18.41,15.88 IC5.9
D6
  Top 0.406: R3.1 24.38,13.08 20.95,13.08 20.95,16.51 19.21,16.51 IC5.10
D9
  Top 0.406: R4.1 27.94,13.72 21.59,13.72 21.59,17.55 IC5.13
D10
  Top 0.406: R5.1 29.59,14.35 22.41,14.35 IC5.14
D11/MOSI  (via drill 0.5)
  Top 0.406: IC5.15 23.21,15.11 24.51,15.11 | 24.51,15.11 29.97,15.11 34.92,13.72 R6.1 | v24.51,16.13 24.51,15.11
  Bottom 0.406: J4.4 11.21,12.36 15.75,16.89 23.75,16.89 v24.51,16.13
GND  (via drill 0.5)
  Top 0.254: IC4.7 5.59,23.62 IC4.19 | IC3.3 IC3.11 33.4,43.81 33.33,43.53 33.34,43.49 33.26,43.26 IC3.9
  other vias: 11.56,15.75 12.45,16.51 28.19,24.51 15.75,36.7 16,38.61 39.37,33.4 40.89,33.4 33.27,33.66 34.54,31.11 1.52,20.07 4.95,21.46 5.33,26.42 28.57,36.83
  pour Top (no thermals): 0,50.8 50.8,50.8 50.8,25.53 49.91,25.78 46.35,12.32 50.8,11.05 50.8,0 0,0
  pour Bottom (no thermals): 0,50.8 50.8,50.8 50.8,25.53 49.91,25.78 46.35,12.32 50.8,11.05 50.8,0 0,0
MCURX  (via drill 0.5)
  Top 0.406: A1.UART_TX 32.13,15.37 29.97,15.88 30.86,19.05 33.4,18.41 35.81,27.3 32.77,28.07 32.77,30.35 29.84,30.35 v29.84,29.97 | v23.24,29.97 20.01,26.99 IC5.30
  Route2 0.406: v29.84,29.97 v23.24,29.97
MCUTX  (via drill 0.5)
  Top 0.406: A1.UART_RX 31.62,18.16 33.91,17.53 36.7,27.81 33.4,28.7 33.4,30.99 v29.08,30.99 | v22.73,30.99 19.21,27.72 IC5.31
  Route2 0.406: v29.08,30.99 v22.73,30.99
MISO  (via drill 0.5)
  Top 0.406: v25.02,17.53 24.03,17.53 IC5.16
  Bottom 0.254: 9.4,11.43 15.49,17.53
  Bottom 0.406: J4.1 9.4,11.43 | 15.49,17.53 v25.02,17.53
N$1
  Top 0.406: IC1.1 10.7,33.77 LED7.C
N$2
  Top 0.305: 24.38,5.25 IC8.1
  Top 0.406: R3.2 24.38,5.25
N$3
  Top 0.305: 27.94,5.25 IC9.1
  Top 0.406: R4.2 27.94,5.25
N$4
  Top 0.305: SJ1.3 18.97,43.51 IC2.1 19.68,41.59 19.68,41.53 19.88,41.34 19.88,39.24 19.79,39.16 19.79,38.73 R15.2
N$5
  Top 0.406: C7.1 36.17,30.52 | 36.17,30.52 A1.VDD | 36.17,30.52 43.69,28.44 J3.2
N$6
  Top 0.305: 31.5,5.25 IC10.1
  Top 0.406: R5.2 31.5,5.25
N$7
  Top 0.305: 34.92,5.25 IC11.1
  Top 0.406: R6.2 34.92,5.25
N$8
  Top 0.305: 20.7,5.25 IC7.1
  Top 0.406: R2.2 20.7,5.25
N$9
  Top 0.406: LED7.A R8.2
N$11
  Top 0.406: IC1.5 R12.1
N$12
  Top 0.508: IC2.3 R14.2 arc-16 R10.1 arc12 C17.1
N$13
  Top 0.254: IC3.2 34.42,46.23
  Top 0.813: 34.42,46.23 L1.2
N$14
  Top 0.254: IC3.4 33.4,46.61
  Top 0.813: 33.4,46.61 L1.1
N$15
  Top 0.254: SJ2.2 30.46,40.39 | 30.46,40.39 | 30.46,40.39 30.93,41.79 30.98,41.96 30.99,41.97 31,41.98 31.15,42.06 31.31,42.15 31.32,42.14 31.33,42.15 31.51,42.1 31.91,42.77 32.04,42.83 32.17,43.19 IC3.7
N$17  (via drill 0.5)
  Top 0.305: IC8.3 IC8.2 IC8.5 25.8,7.39
  Top 0.406: 25.8,7.39 26.29,8.13 v26.29,10.54
  Bottom 0.406: v26.29,10.54 26.29,16.76 27.43,17.91 28.19,18.57 LED3.C
N$18  (via drill 0.5)
  Top 0.305: IC9.3 IC9.2 IC9.5 29.23,7.39
  Top 0.406: 29.23,7.39 29.72,8.06 v29.78,10.54
  Bottom 0.406: v29.78,10.54 29.78,17.97 33.27,20.7 33.27,24.8 LED4.C
N$19  (via drill 0.5)
  Top 0.305: IC10.3 IC10.2 IC10.5 32.91,7.39
  Top 0.406: 32.91,7.39 33.4,8.06 v33.4,10.41
  Bottom 0.406: v33.4,10.41 33.4,18.29 35.56,20.32 35.56,27.43 30.61,32.38 26.6,32.38 LED5.C
N$20  (via drill 0.5, 0.55)
  Top 0.305: IC11.3 IC11.2 IC11.5 36.6,7.39
  Top 0.406: 36.6,7.39 37.08,8.06 v37.72,11.05
  Route2 0.406: v37.72,11.05 37.72,21.84 26.8,21.84 26.8,24.13 22.86,24.13 arc-90 v22.61,24.38
  Bottom 0.406: LED6.K v22.61,24.38
N$21  (via drill 0.5)
  Top 0.305: IC7.3 IC7.2 IC7.5 22.25,7.39
  Top 0.406: 22.25,7.39 22.73,8.13 v22.73,10.92
  Route15 0.406: v22.73,10.92 22.73,17.14 v19.18,20.19
  Bottom 0.406: v19.18,20.19 21.48,20.19 LED2.C
N$22
  Top 0.305: IC6.1 17.91,5.21
  Top 0.406: R1.2 17.14,5.21 17.91,5.21
N$23
  Top 0.254: IC3.8 32.57,42.65 32.56,42.63 32.38,42.04 C4.1 31.37,41.66 30.73,39.75 30.61,39.75 SJ2.3
N$24  (via drill 0.5)
  Top 0.305: IC6.3 IC6.2 IC6.5 18.56,7.39
  Top 0.406: 18.56,7.39 19.05,8.06 v19.05,10.67
  Route15 0.406: v19.05,10.67 19.05,16 18.16,17.14 17.91,27.69 v16.26,27.56
  Bottom 0.406: v16.26,27.56 LED1.C
N$26
  Top 0.254: IC4.4 2.79,23.62 2.45,22.81 2.39,22.81 2.2,22.62 2.2,22.23 SJ3.2
N$27
  Top 0.254: IC4.1 3.6,25.86 3.56,25.91
  Top 0.813: 3.56,25.91 3.56,27.08 L2.1
N$28
  Top 0.254: 6.86,26.16 6.86,25.43 IC4.10
  Top 0.813: L2.2 6.51,27.53 6.86,27.18 6.86,26.16
N$30
  Top 0.254: C2.1 6.55,21.86 IC4.6
N$31
  Top 0.254: IC4.8 7.41,24.13 7.41,23.7 | 7.41,23.7 7.6,23.51 11.86,23.51 R13.2 | 7.41,23.7 7.41,20.9 7.69,20.62 R11.1 C16.1
SCK
  Top 0.254: 16,18.03 9.4,11.43
  Top 0.406: IC5.17 18.41,19.04 17.4,18.03 16,18.03 | 9.4,11.43 9.4,9.65 J4.3
USB_VIN
  Top 0.406: 17.02,42.29 USB1.1-PWR
  Top 0.508: C5.1 IC1.4 7.13,36.19 6.43,37.2 6.43,38.53 8.26,40.36 11.91,40.36 12.42,39.86 12.45,39.88 12.62,39.65 12.86,39.42 12.86,39.35 J5.2
  Top 0.61: R8.1 15.89,34.83 15.89,35.05 15.59,35.34 13.97,35.34 14,35.38 J5.2 14.17,37.9 | 17.02,42.29 17.02,41.51
  Top 0.813: D1.A 10.94,32.64 16.64,32.64 16.63,32.64 R8.1 | 17.02,41.51 14.22,39.62 J5.2
UVLO  (via drill 0.5)
  Top 0.254: IC4.3 2.29,24.13 v2.03,23.88 | IC3.6 30.86,42.8 28.96,44.07 26.29,46.74 v26.29,48.51
  Top 0.305: SJ1.2 21.21,44.32 v21.84,44.96
  Route2 0.305: v21.84,44.96 25.4,48.51 v26.29,48.51
  Bottom 0.254: v2.03,23.88 0.59,23.88 0.59,26.92 0.67,27.85 1.02,28.19 1.02,30.4 1.91,33.75 4.03,38.2 5.08,39.7 6.42,41.43 9.49,44.51 12.39,46.63 12.93,47 16.87,48.84 17.32,48.96
  Bottom 0.305: 17.32,48.96 21.32,44.96 v21.84,44.96
V+  (via drill 0.5)
  Top 0.254: IC4.2 2.67,24.64 2.41,25.02 | IC3.5 32,46.1
  Top 0.305: SJ1.1 v18.03,45.21
  Top 0.508: SJ3.3 1.22,22.78 0.77,23.23 0.77,23.24 0.77,24.14 1.52,25.02 | IC2.5 22.73,40.64 23.24,40.01 25.53,40.01 R15.1 25.53,37.47 R14.1 | C11.1 arc-227 7.23,29.75
  Top 0.813: 7.23,29.75 D2.C 9.16,29.74 D1.C 11.2,29.74 12.06,30.61 v13.21,30.61 13.34,30.61 | C11.1 6.02,28.95 3.28,28.95 2.92,28.59 2.92,27.89 2.03,26.99 C12.1 1.52,25.02 2.41,25.02 | v25.65,36.32 25.65,37.34 25.53,37.47 | v30.86,48.64 C8.1 32,46.1
  Route15 0.813: v30.86,48.64 28.77,43.7 28.77,41.97 28.14,41.33 27.77,41.33 v25.65,36.32
  Bottom 0.305: v18.03,45.21 18.03,36.58 arc90 18.29,36.32 18.54,36.32
  Bottom 0.813: v13.21,30.61 16.46,33.86 16.46,34.25 18.54,36.32 v25.65,36.32
VBATT  (via drill 0.55, 0.7)
  Top 0.508: 9.14,36.32 8.98,36.16 IC1.3 8.02,35.67 8,35.69 8,35.26 7.92,35.19 7.92,33.22 D2.A
  Top 0.813: 27.69,42.93 v27.69,42.42 | 27.69,42.93 v27.69,43.69 | J1.2 26.38,42.93 27.69,42.93 | 9.14,36.32 9.14,37.3 C6.1 7.6,37.35 v7.37,37.59
  Route15 0.813: v27.69,42.42 v27.69,43.69 22.73,48.64 v19.18,48.64 18.41,48.64 v7.37,37.59
VPP  (via drill 0.5)
  Top 0.254: IC4.9 7.36,24.63 7.62,24.89
  Top 0.813: 8.38,24.89 7.62,24.89 | 8.38,24.89 C15.1 C14.1 12.63,24.64 R13.1 13.34,24.57 v13.34,26.29 v13.34,27.43 v13.34,28.57 | C13.1 8.38,27.05 8.38,24.89
  Bottom 0.254: 27.3,25.4 LED6.A
  Bottom 0.813: LED4.A 28.63,26.72 28.51,26.61 | 28.51,26.61 27.3,25.4 | 28.51,26.61 27.56,27.56 v27.56,28.45 26.59,28.45 LED5.A
  pour Route15 (no thermals): 0,50.8 50.8,50.8 50.8,25.53 49.91,25.78 46.35,12.32 50.8,11.05 50.8,0 0,0

### Text on the board
tNames: Batt | gnd | + | LED
bNames: Photocell
tDocu: 3.3V | VBT
bDocu: DM Jenkins / Smart-Trap Lighting- PRG Spectrum v3 / April 13, 2018 / Red-D3, AMBER-D5, Yellow-D6 / Green D9, Blue D10, UV D11 / D4 is LED enable (all colors) / Photocell divider on A1 / powered by D2